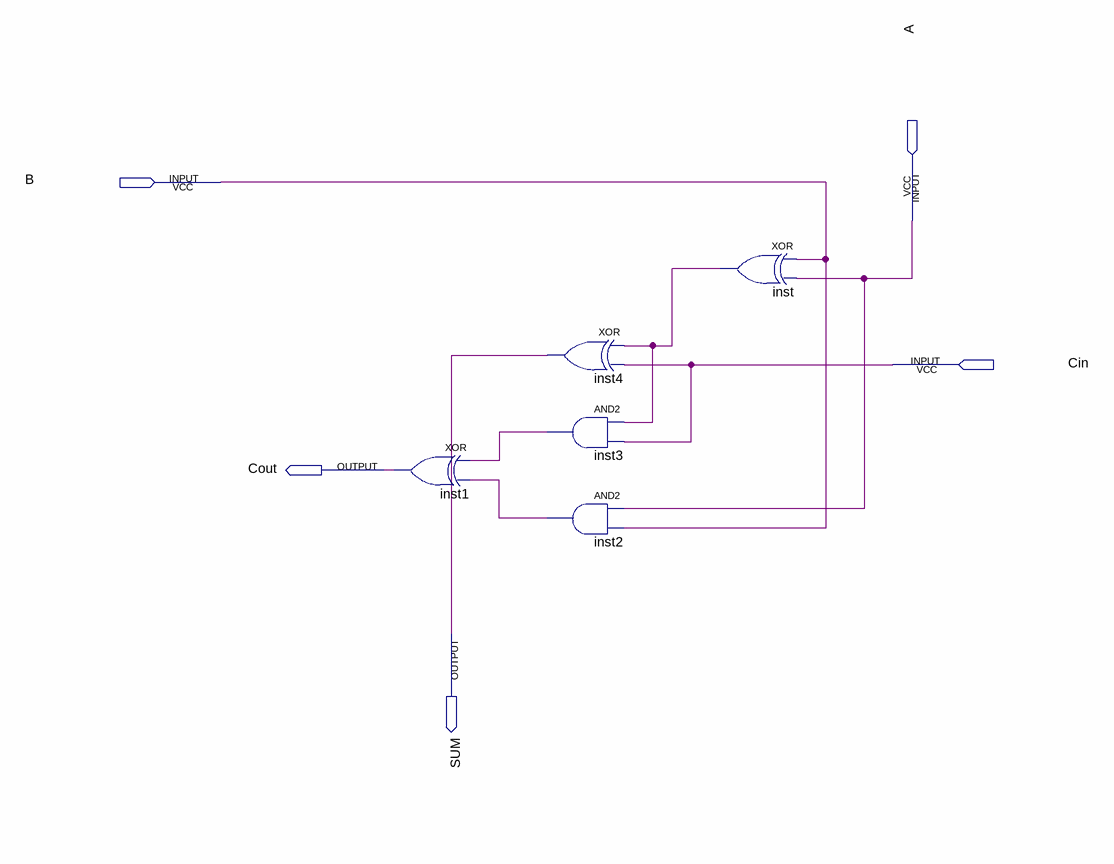
[diagram p0: schematic sheet]
// Quartus schematic FullAdder.bdf as structural Verilog: 5 symbols, 5 pins
module FullAdder (
  input  B,
  input  A,
  input  Cin,
  output Cout,
  output SUM
);

  wire inst2_out, inst3_out, inst_out;

  xor inst1 (Cout, inst3_out, inst2_out);
  xor inst4 (SUM, inst_out, Cin);
  and inst3 (inst3_out, inst_out, Cin);
  and inst2 (inst2_out, A, B);
  xor inst (inst_out, B, A);
endmodule
